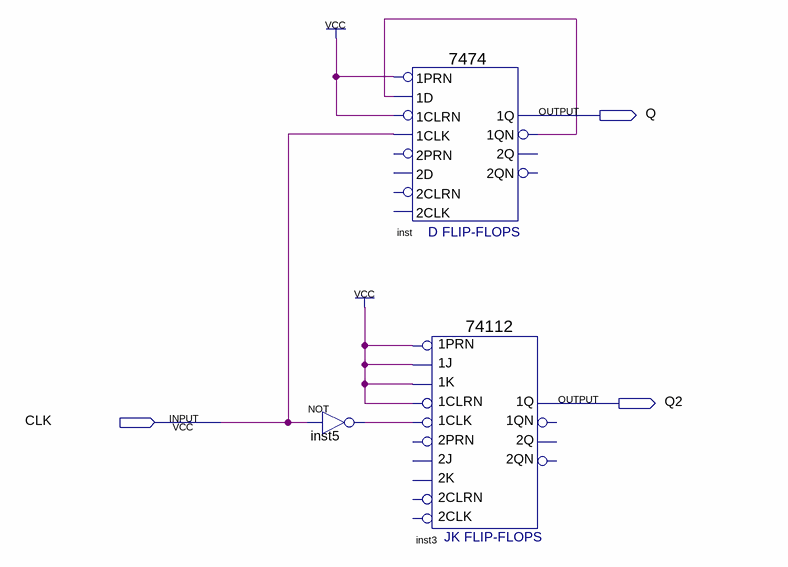
[diagram p0: schematic sheet]
// Quartus schematic pj604.bdf as structural Verilog: 3 symbols, 3 pins
module pj604 (
  input  CLK,
  output Q,
  output Q2
);

  wire inst5_out, inst_1qn;

  not inst5 (inst5_out, CLK);
  \7474  inst (
    .\1CLK (CLK), .\1D (inst_1qn), .\1PRN (1'b1), .\1CLRN (1'b1), .\1QN (inst_1qn), .\1Q (Q));  // open: 2D, 2PRN, 2CLK, 2CLRN, 2Q, 2QN
  \74112  inst3 (
    .\1K (1'b1), .\1J (1'b1), .\1PRN (1'b1), .\1CLK (inst5_out), .\1CLRN (1'b1), .\1Q (Q2));  // open: 2K, 2J, 2PRN, 2CLK, 2CLRN, 1QN, 2Q, 2QN
endmodule
